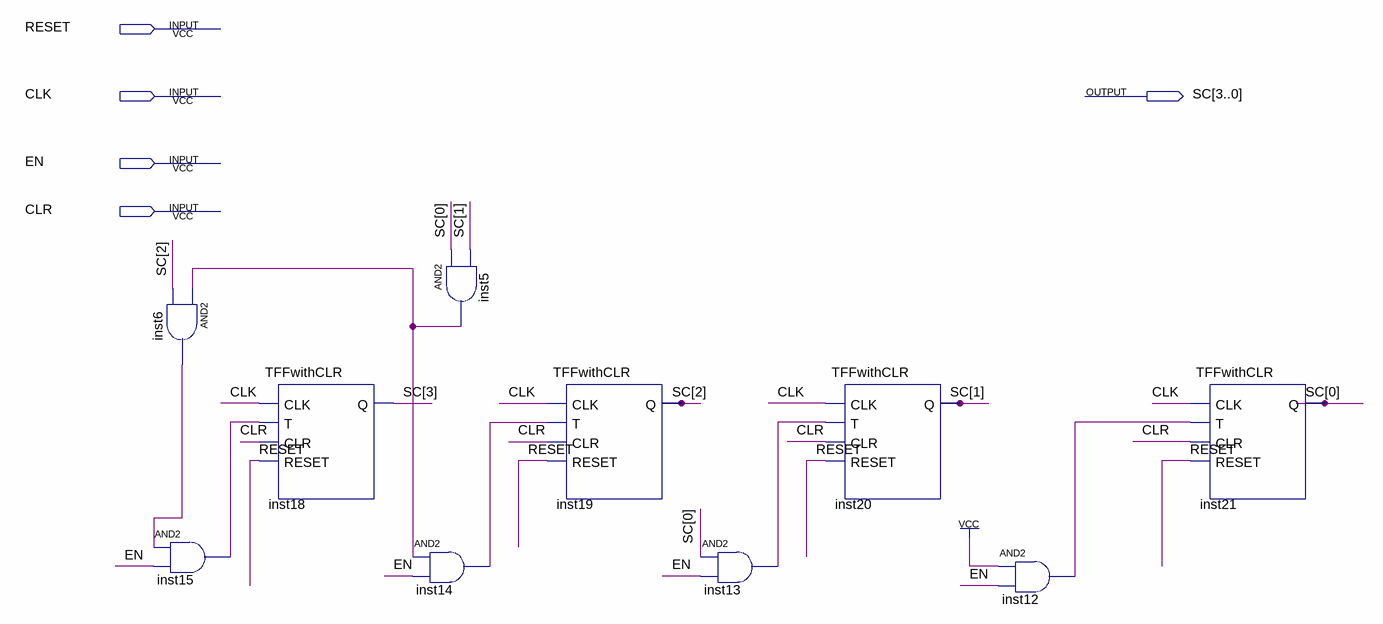
[diagram p0: schematic sheet]
// Quartus schematic SCounter.bdf as structural Verilog: 10 symbols, 5 pins
module SCounter (
  input  RESET,
  input  CLK,
  input  EN,
  input  CLR,
  output [3:0] SC
);

  wire inst5_out, inst6_out, inst12_out, inst13_out, inst14_out, inst15_out;

  and inst6 (inst6_out, inst5_out, SC[2]);
  and inst15 (inst15_out, inst6_out, EN);
  TFFwithCLR inst18 (.CLK(CLK), .T(inst15_out), .CLR(CLR), .RESET(RESET), .Q(SC[3]));
  and inst5 (inst5_out, SC[0], SC[1]);
  and inst14 (inst14_out, inst5_out, EN);
  TFFwithCLR inst19 (.CLK(CLK), .T(inst14_out), .CLR(CLR), .RESET(RESET), .Q(SC[2]));
  and inst13 (inst13_out, SC[0], EN);
  TFFwithCLR inst20 (.CLK(CLK), .T(inst13_out), .CLR(CLR), .RESET(RESET), .Q(SC[1]));
  and inst12 (inst12_out, 1'b1, EN);
  TFFwithCLR inst21 (.CLK(CLK), .T(inst12_out), .CLR(CLR), .RESET(RESET), .Q(SC[0]));
endmodule
